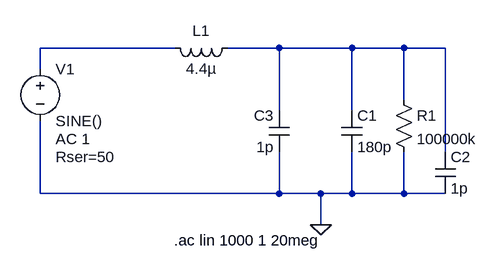
[diagram p0: schematic Pickup 2016.asc]
Pickup 2016.asc, the LTspice schematic file:
Version 4
SHEET 1 880 680
WIRE 16 -32 -192 -32
WIRE 176 -32 96 -32
WIRE 288 -32 176 -32
WIRE 368 -32 288 -32
WIRE 432 -32 368 -32
WIRE -192 0 -192 -32
WIRE 368 48 368 -32
WIRE 176 64 176 -32
WIRE 288 64 288 -32
WIRE 432 128 432 -32
WIRE -192 192 -192 80
WIRE 176 192 176 128
WIRE 176 192 -192 192
WIRE 240 192 176 192
WIRE 288 192 288 128
WIRE 288 192 240 192
WIRE 368 192 368 128
WIRE 368 192 288 192
WIRE 432 192 368 192
WIRE 240 240 240 192
FLAG 240 240 0
SYMBOL cap 272 64 R0
SYMATTR InstName C1
SYMATTR Value 180p
SYMBOL cap 416 128 R0
SYMATTR InstName C2
SYMATTR Value 1p
SYMBOL ind 112 -48 R90
WINDOW 0 5 56 VBottom 2
WINDOW 3 32 56 VTop 2
SYMATTR InstName L1
SYMATTR Value 4.4µ
SYMBOL voltage -192 -16 R0
WINDOW 123 24 124 Left 2
WINDOW 39 24 152 Left 2
SYMATTR InstName V1
SYMATTR Value SINE()
SYMATTR Value2 AC 1
SYMATTR SpiceLine Rser=50
SYMBOL cap 192 128 R180
WINDOW 0 24 56 Left 2
WINDOW 3 24 8 Left 2
SYMATTR InstName C3
SYMATTR Value 1p
SYMBOL res 352 32 R0
SYMATTR InstName R1
SYMATTR Value 100000k
TEXT 14 264 Left 2 !.ac lin 1000 1 20meg

The netlist it stands for:
* Pickup 2016.asc
C1 N002 0 180p
C2 N002 0 1p
L1 N002 N001 4.4µ
V1 N001 0 SINE() AC 1 Rser=50
C3 0 N002 1p
R1 N002 0 100000k
.ac lin 1000 1 20meg
.backanno
.end